# Altium schematic sheet LAN interface.SchDoc
size A4; SheetNumber: 3; SheetTotal: 4
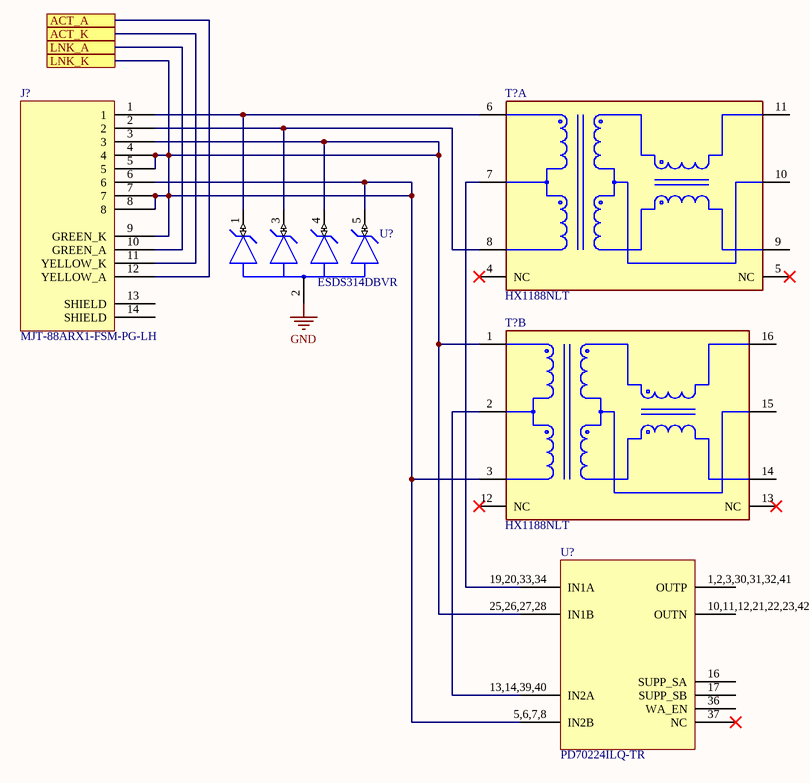
[diagram p0: LAN interface.SchDoc]

## Parts
(Parts that share a designator on the sheet are numbered #1, #2 ... from top to bottom, then left to right.)
J?  MJT-88ARX1-FSM-PG-LH  [MTJ88ARX1FSMPGLG]
T?#1  HX1188NLT  [FP-HX1188NLT-MFG]  (part A of 2)
T?#2  HX1188NLT  [FP-HX1188NLT-MFG]  (part B of 2)
U?#1  ESDS314DBVR  [FP-DBV0005A-IPC_A]
U?#2  PD70224ILQ-TR  [PD70224ILQTR]

## Ports
ACT_A, ACT_K, LNK_A, LNK_K

## Nets
GND: U?#1.2(GND)
ACT_A: J?.12(YELLOW_A) ; port ACT_A
ACT_K: J?.11(YELLOW_K) ; port ACT_K
LNK_A: J?.10(GREEN_A) ; port LNK_A
LNK_K: J?.3 J?.4 J?.5 J?.6 J?.7 J?.8 J?.9(GREEN_K) T?#2.1(TD+) T?#2.3(TD-) U?#1.4(I/O3) U?#1.5(I/O4) U?#2.5,6,7,8(IN2B) U?#2.25,26,27,28(IN1B) ; port LNK_K
NetJ?_1: J?.1 T?#1.6(RD+) U?#1.1(I/O1)
NetJ?_2: J?.2 T?#1.8(RD-) U?#1.3(I/O2)
NetT?#1_7: T?#1.7(RCT) U?#2.19,20,33,34(IN1A)
NetT?#2_2: T?#2.2(TCT) U?#2.13,14,39,40(IN2A)

Not connected (* = marked no-connect by the designer): J? 13(SHIELD) 14(SHIELD); T?#1 4(NC)* 5(NC)* 9(RX-) 10(CMT) 11(RX+); T?#2 12(NC)* 13(NC)* 14(TX-) 15(CMT) 16(TX+); U?#2 1,2,3,30,31,32,41(OUTP) 10,11,12,21,22,23,42(OUTN) 16(SUPP_SA) 17(SUPP_SB) 36(WA_EN) 37(NC)*

## Library data of the parts
J? = MTJ-88ARX1-FSM-PG-LH: Supplier 1: TME; Supplier Part Number 1: MTJ88ARX1FSMPGLH
T?#1 T?#2 = CMP-2000-06432-2: XFRMR MAGNETIC 1PORT 1:1 10/100; DC Resistance (DCR): 1.5R; Insertion Loss: -3dB; Shielding: Unshielded; Return Loss: -12dB; Lead/Base Style: Gull Wing; Isolation Voltage: 1.5kV; Length: 12.7mm; Number of Pins: 16; Depth: 9.65mm; Turns Ratio: 1:1; Max Operating Temperature: 85°C; RoHS Compliant: Yes; Termination: SMD/SMT; Height: 5.97mm; Radiation Hardening: No; Height - Seated (Max): 6.22mm; Width: 7.11mm; Series: -; Packaging: Tape and Reel; Min Operating Temperature: -40°C; Mount: Surface Mount; Package Quantity: 1
U?#1 = CMP-04985-000014-1: FAMILY OF UNI-DIRECTIONAL SURGE; Peak Pulse Current: 25A; Number of Unidirectional Channels: 4; Power Line Protection: No; Interface: USB; Min Breakdown Voltage: 4.5V; Peak Pulse Power: 170W; Clamping Voltage: 6.5V; Reverse Standoff Voltage: 3.6V; RoHS Compliant: Yes; Packaging: Cut Tape; Resistor Type: Zener; Min Operating Temperature: -40°C; Number of Channels: 4; Case/Package: SOT-23-5; Mount: Surface Mount; Max Operating Temperature: 125°C
U?#2 = PD70224ILQ-TR: Supplier 1: TME; Supplier Part Number 1: PD70224ILQ-TR